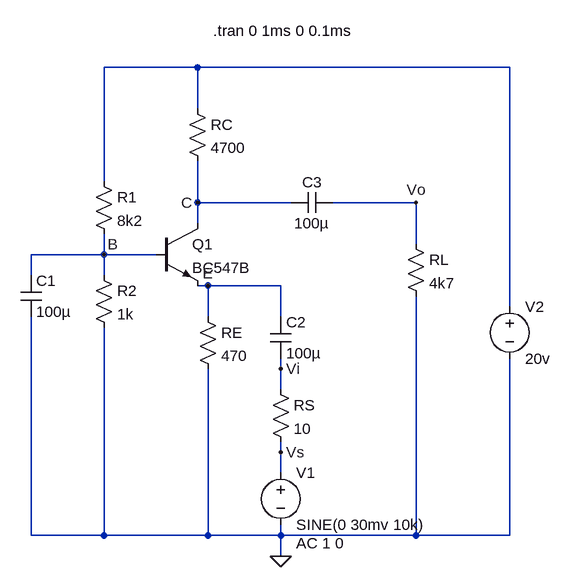
[diagram p0: schematic TBJ_BN547B.asc]
TBJ_BN547B.asc, the LTspice schematic file:
Version 4
SHEET 1 880 680
WIRE 176 -112 32 -112
WIRE 656 -112 176 -112
WIRE 176 -48 176 -112
WIRE 32 64 32 -112
WIRE 176 96 176 32
WIRE 320 96 176 96
WIRE 512 96 384 96
WIRE 176 128 176 96
WIRE 512 160 512 96
WIRE 32 176 32 144
WIRE 32 176 -80 176
WIRE 112 176 32 176
WIRE -80 208 -80 176
WIRE 32 208 32 176
WIRE 192 224 176 224
WIRE 304 224 192 224
WIRE 656 256 656 -112
WIRE 192 272 192 224
WIRE 304 272 304 224
WIRE 304 352 304 336
WIRE 304 384 304 352
WIRE 304 480 304 464
WIRE 304 512 304 480
WIRE -80 608 -80 272
WIRE 32 608 32 288
WIRE 32 608 -80 608
WIRE 192 608 192 352
WIRE 192 608 32 608
WIRE 304 608 304 592
WIRE 304 608 192 608
WIRE 512 608 512 240
WIRE 512 608 304 608
WIRE 656 608 656 336
WIRE 656 608 512 608
WIRE 304 640 304 608
FLAG 304 640 0
FLAG 512 96 Vo
FLAG 304 480 Vs
FLAG 304 352 Vi
FLAG 176 96 C
FLAG 32 176 B
FLAG 192 224 E
SYMBOL npn 112 128 R0
SYMATTR InstName Q1
SYMATTR Value BC547B
SYMBOL cap -96 208 R0
SYMATTR InstName C1
SYMATTR Value 100µ
SYMBOL res 16 192 R0
SYMATTR InstName R2
SYMATTR Value 1k
SYMBOL res 16 48 R0
SYMATTR InstName R1
SYMATTR Value 8k2
SYMBOL res 176 256 R0
SYMATTR InstName RE
SYMATTR Value 470
SYMBOL cap 288 272 R0
SYMATTR InstName C2
SYMATTR Value 100µ
SYMBOL res 288 368 R0
SYMATTR InstName RS
SYMATTR Value 10
SYMBOL voltage 304 496 R0
WINDOW 123 24 124 Left 2
WINDOW 39 24 152 Left 2
SYMATTR Value2 AC 1 0
SYMATTR InstName V1
SYMATTR Value SINE(0 30mv 10k)
SYMBOL res 160 -64 R0
SYMATTR InstName RC
SYMATTR Value 4700
SYMBOL res 496 144 R0
SYMATTR InstName RL
SYMATTR Value 4k7
SYMBOL cap 384 80 R90
WINDOW 0 0 32 VBottom 2
WINDOW 3 32 32 VTop 2
SYMATTR InstName C3
SYMATTR Value 100µ
SYMBOL voltage 656 240 R0
SYMATTR InstName V2
SYMATTR Value 20v
TEXT 200 -168 Left 2 !.tran 0 1ms 0 0.1ms

The netlist it stands for:
* TBJ_BN547B.asc
Q1 C B E 0 BC547B
C1 B 0 100µ
R2 B 0 1k
R1 N001 B 8k2
RE E 0 470
C2 E Vi 100µ
RS Vi Vs 10
V1 Vs 0 SINE(0 30mv 10k) AC 1 0
RC N001 C 4700
RL Vo 0 4k7
C3 Vo C 100µ
V2 N001 0 20v
.model NPN NPN
.model PNP PNP
.lib standard.bjt
.tran 0 1ms 0 0.1ms
.backanno
.end